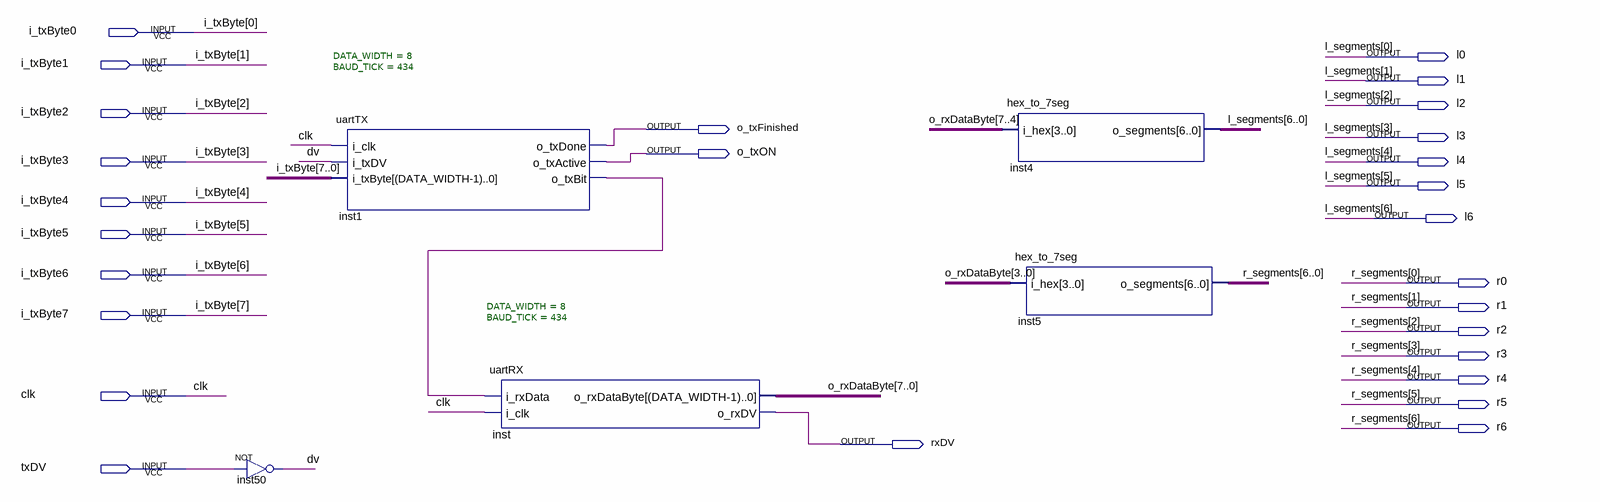
[diagram p0: schematic sheet]
// Quartus schematic uart_toplevel.bdf as structural Verilog: 5 symbols, 27 pins
module uart_toplevel (
  input  i_txByte0,
  input  i_txByte1,
  input  i_txByte2,
  input  i_txByte3,
  input  i_txByte4,
  input  i_txByte5,
  input  i_txByte6,
  input  i_txByte7,
  input  clk,
  input  txDV,
  output l0,
  output l1,
  output l2,
  output o_txFinished,
  output l3,
  output o_txON,
  output l4,
  output l5,
  output l6,
  output r0,
  output r1,
  output r2,
  output r3,
  output r4,
  output r5,
  output r6,
  output rxDV
);

  wire dv, inst1_o_txbit;
  wire [7:0] o_rxDataByte;

  not inst50 (dv, txDV);
  uartTX #(.DATA_WIDTH(8), .BAUD_TICK(434)) inst1 (
    .i_clk(clk), .i_txDV(dv),
    .i_txByte({i_txByte7, i_txByte6, i_txByte5, i_txByte4, i_txByte3, i_txByte2, i_txByte1, i_txByte0}),
    .o_txDone(o_txFinished), .o_txActive(o_txON), .o_txBit(inst1_o_txbit));
  uartRX #(.DATA_WIDTH(8), .BAUD_TICK(434)) inst (
    .i_rxData(inst1_o_txbit), .i_clk(clk), .o_rxDataByte(o_rxDataByte), .o_rxDV(rxDV));
  hex_to_7seg inst4 (.i_hex(o_rxDataByte[7:4]), .o_segments({l6, l5, l4, l3, l2, l1, l0}));
  hex_to_7seg inst5 (.i_hex(o_rxDataByte[3:0]), .o_segments({r6, r5, r4, r3, r2, r1, r0}));

  // Other names for the same wires on the sheet: l_segments[6:0] = {l6, l5, l4, l3, l2, l1, l0};
  //   r_segments[6:0] = {r6, r5, r4, r3, r2, r1, r0}
endmodule
